# EAGLE schematic slave_v1_2 (EAGLE 9.6.2)
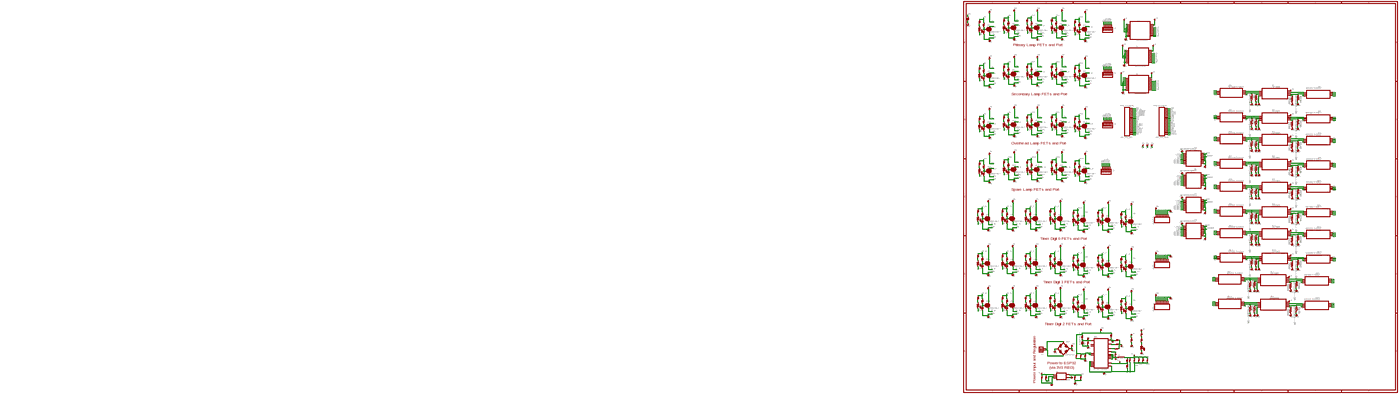
[diagram p0: schematic, sheet 1, overview]
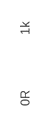
[diagram p1: schematic, sheet 1, part 1 of 5]
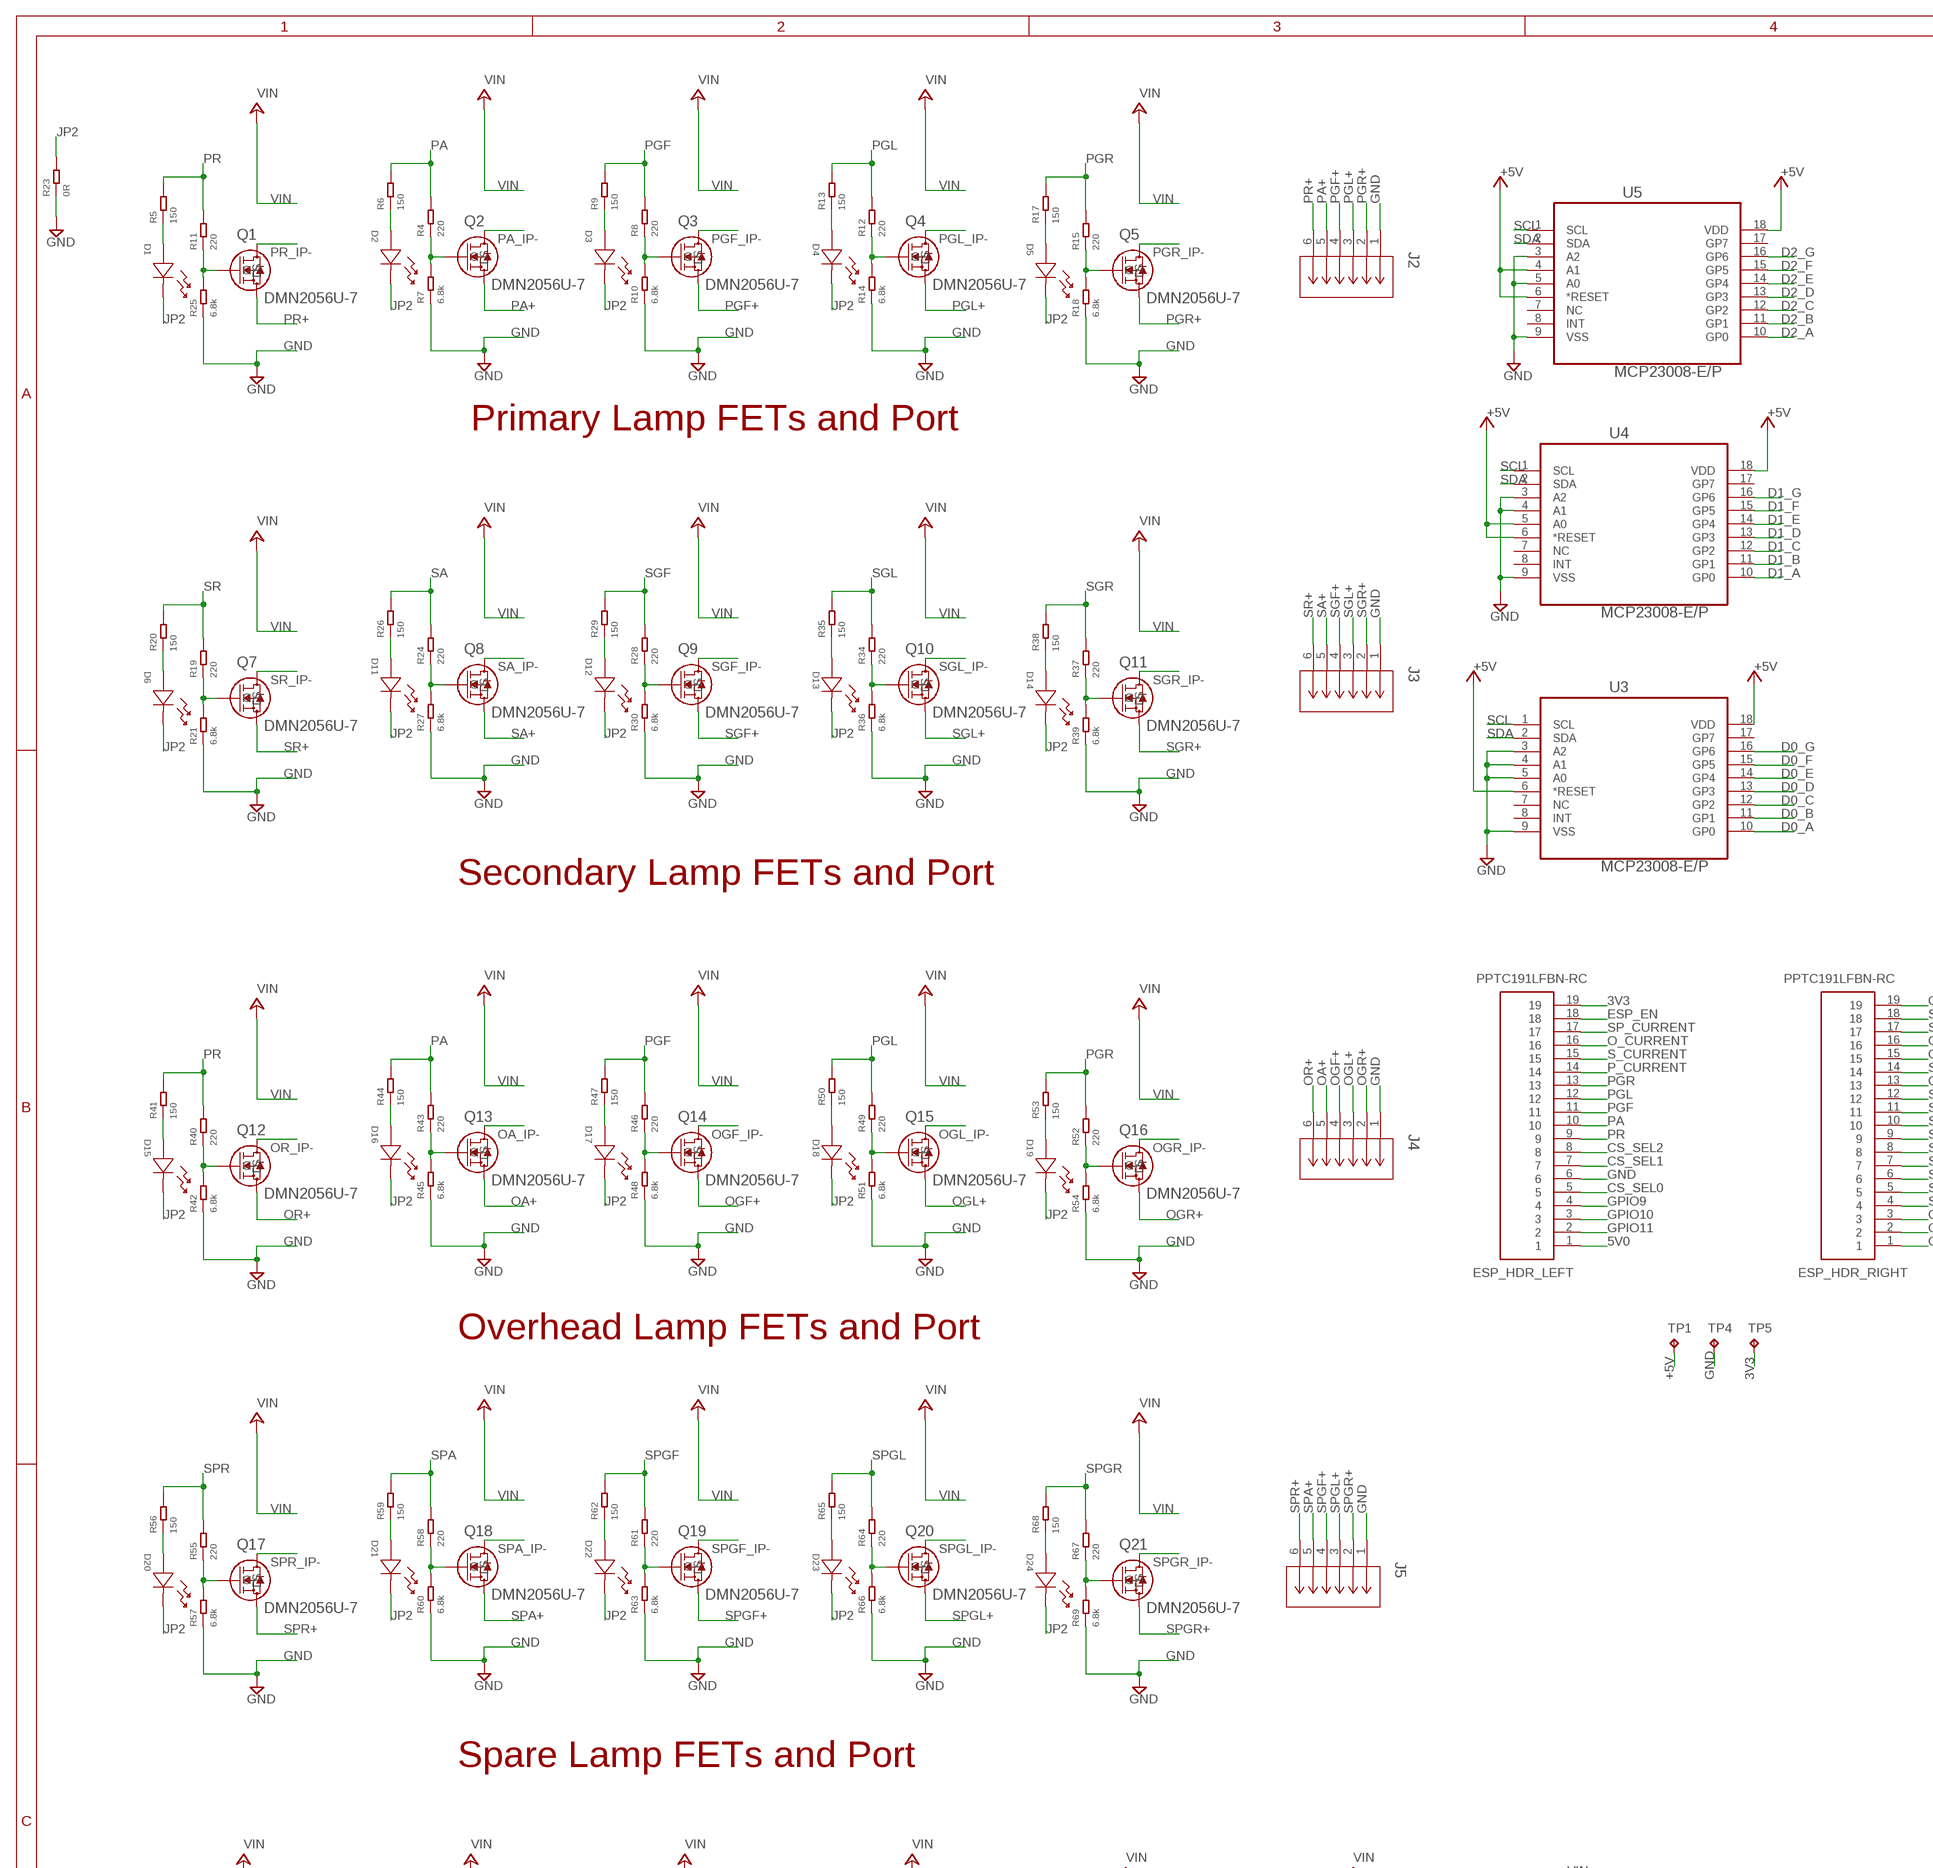
[diagram p2: schematic, sheet 1, part 2 of 5]
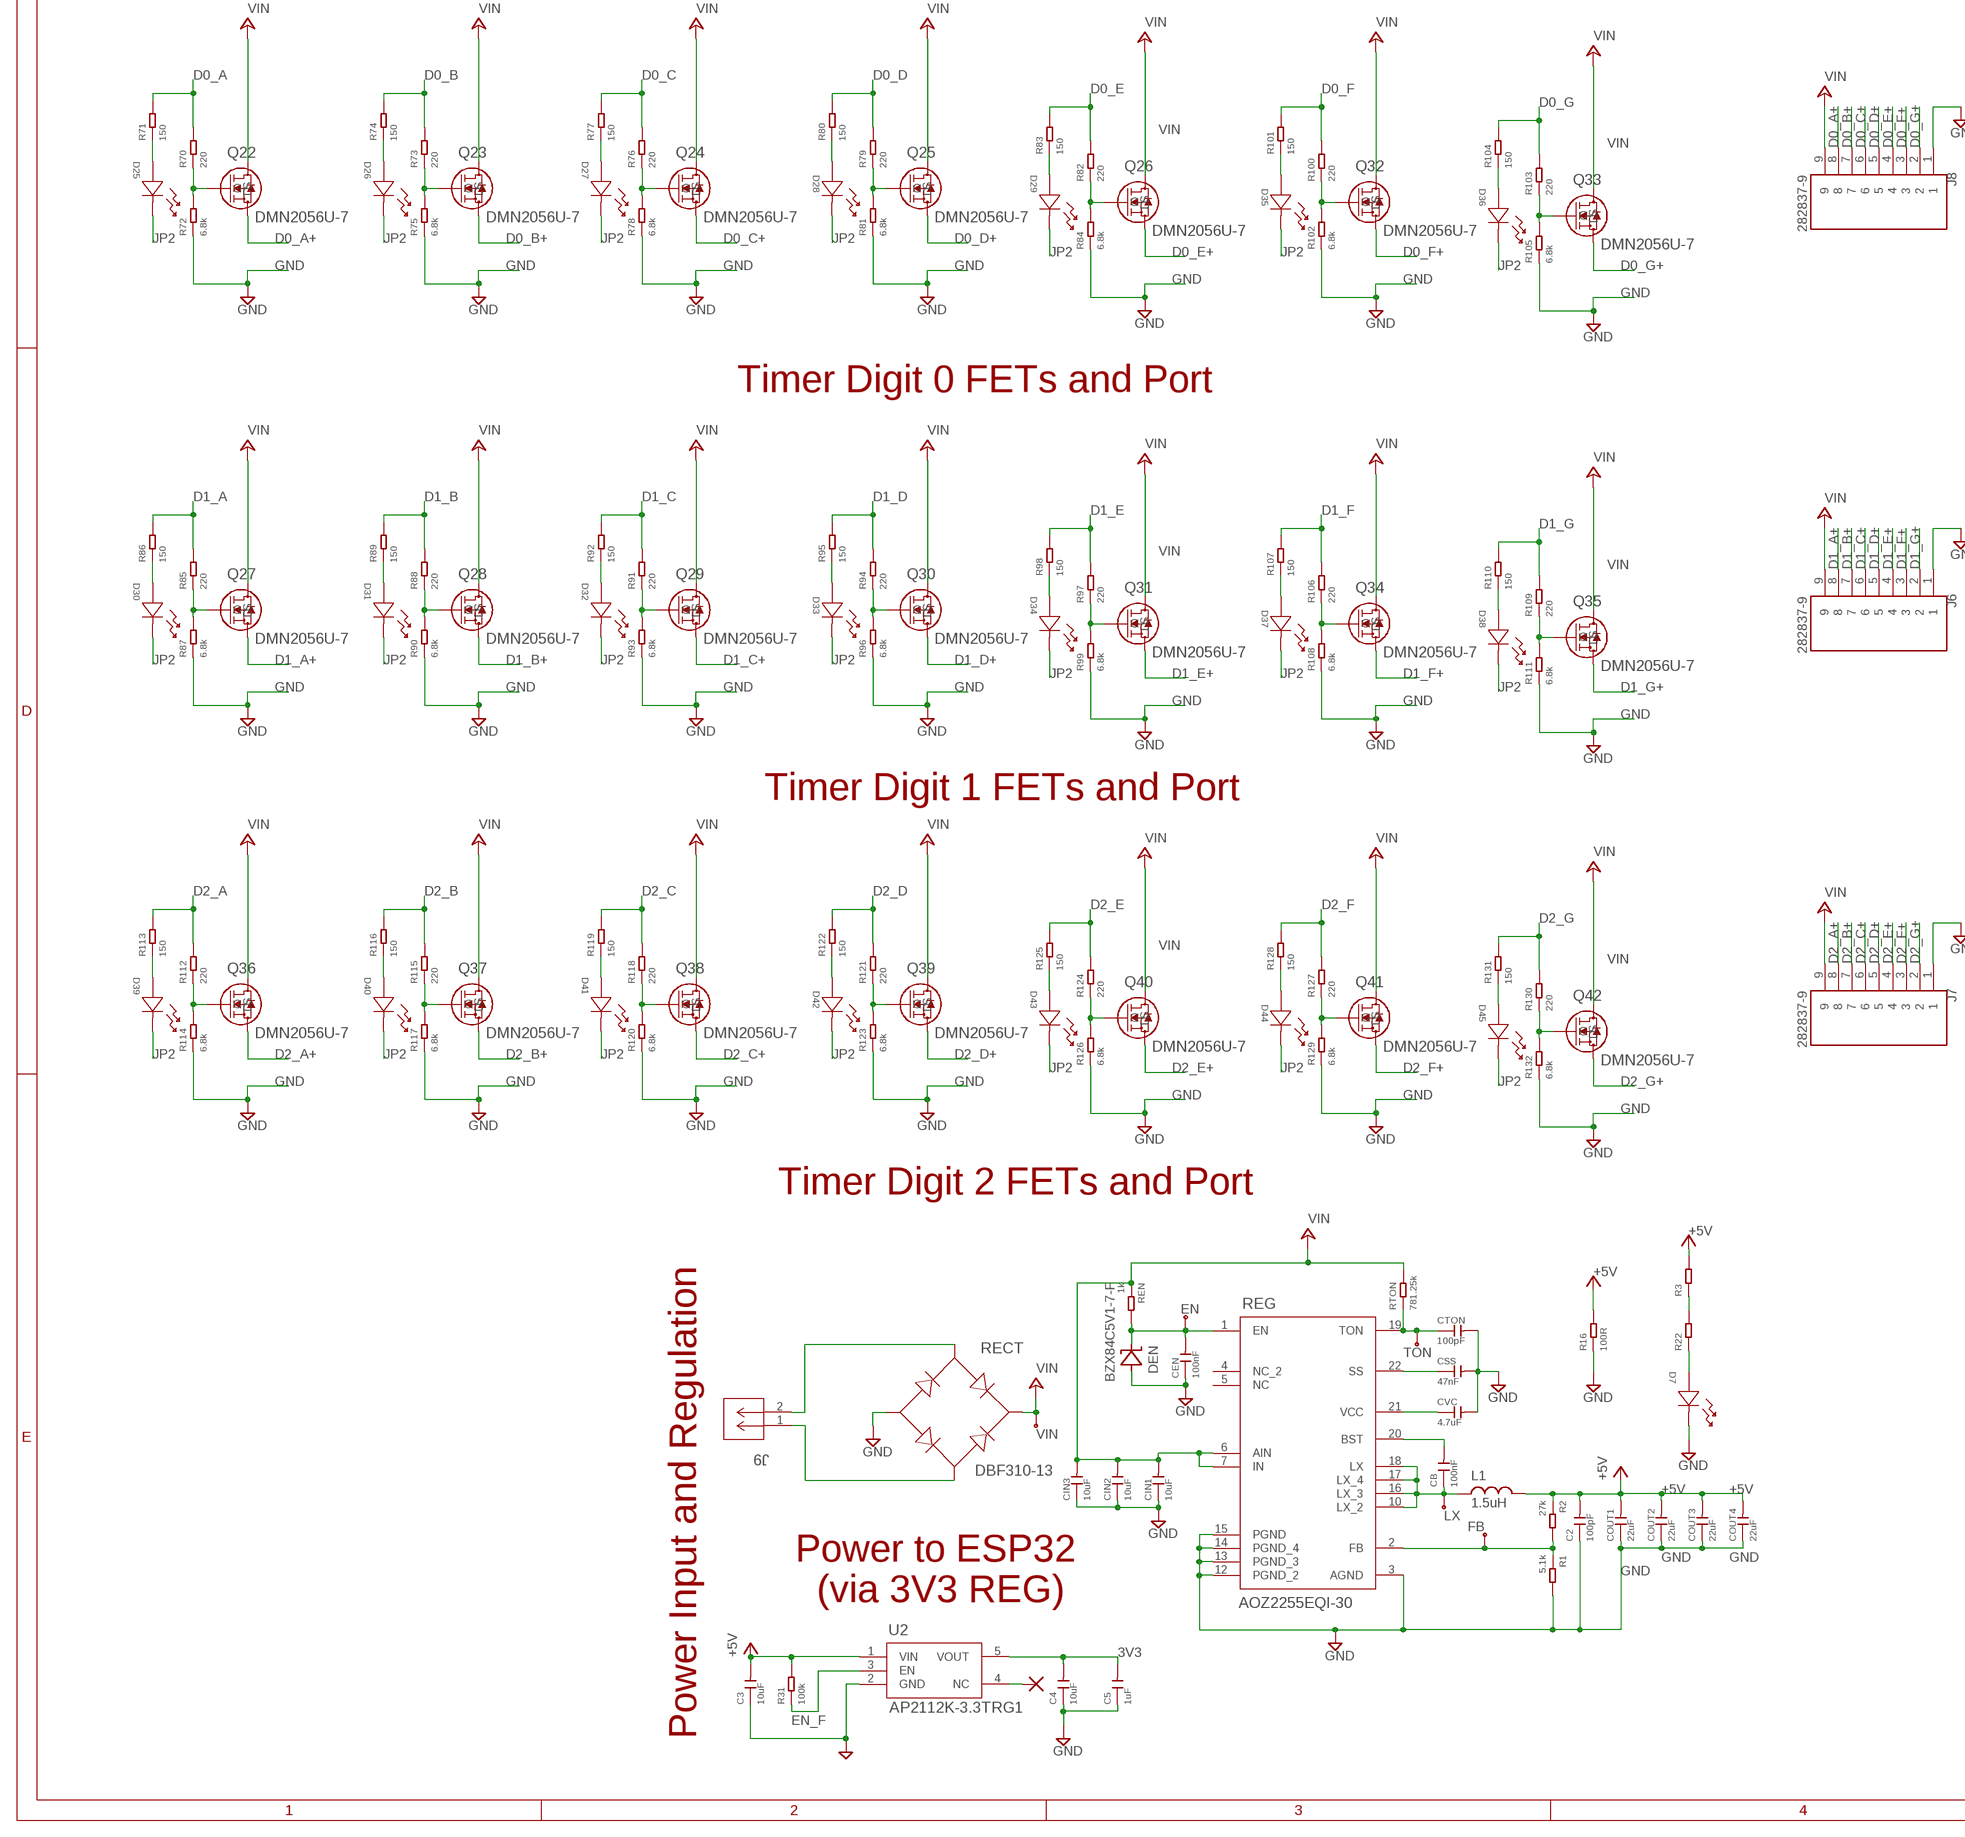
[diagram p3: schematic, sheet 1, part 3 of 5]
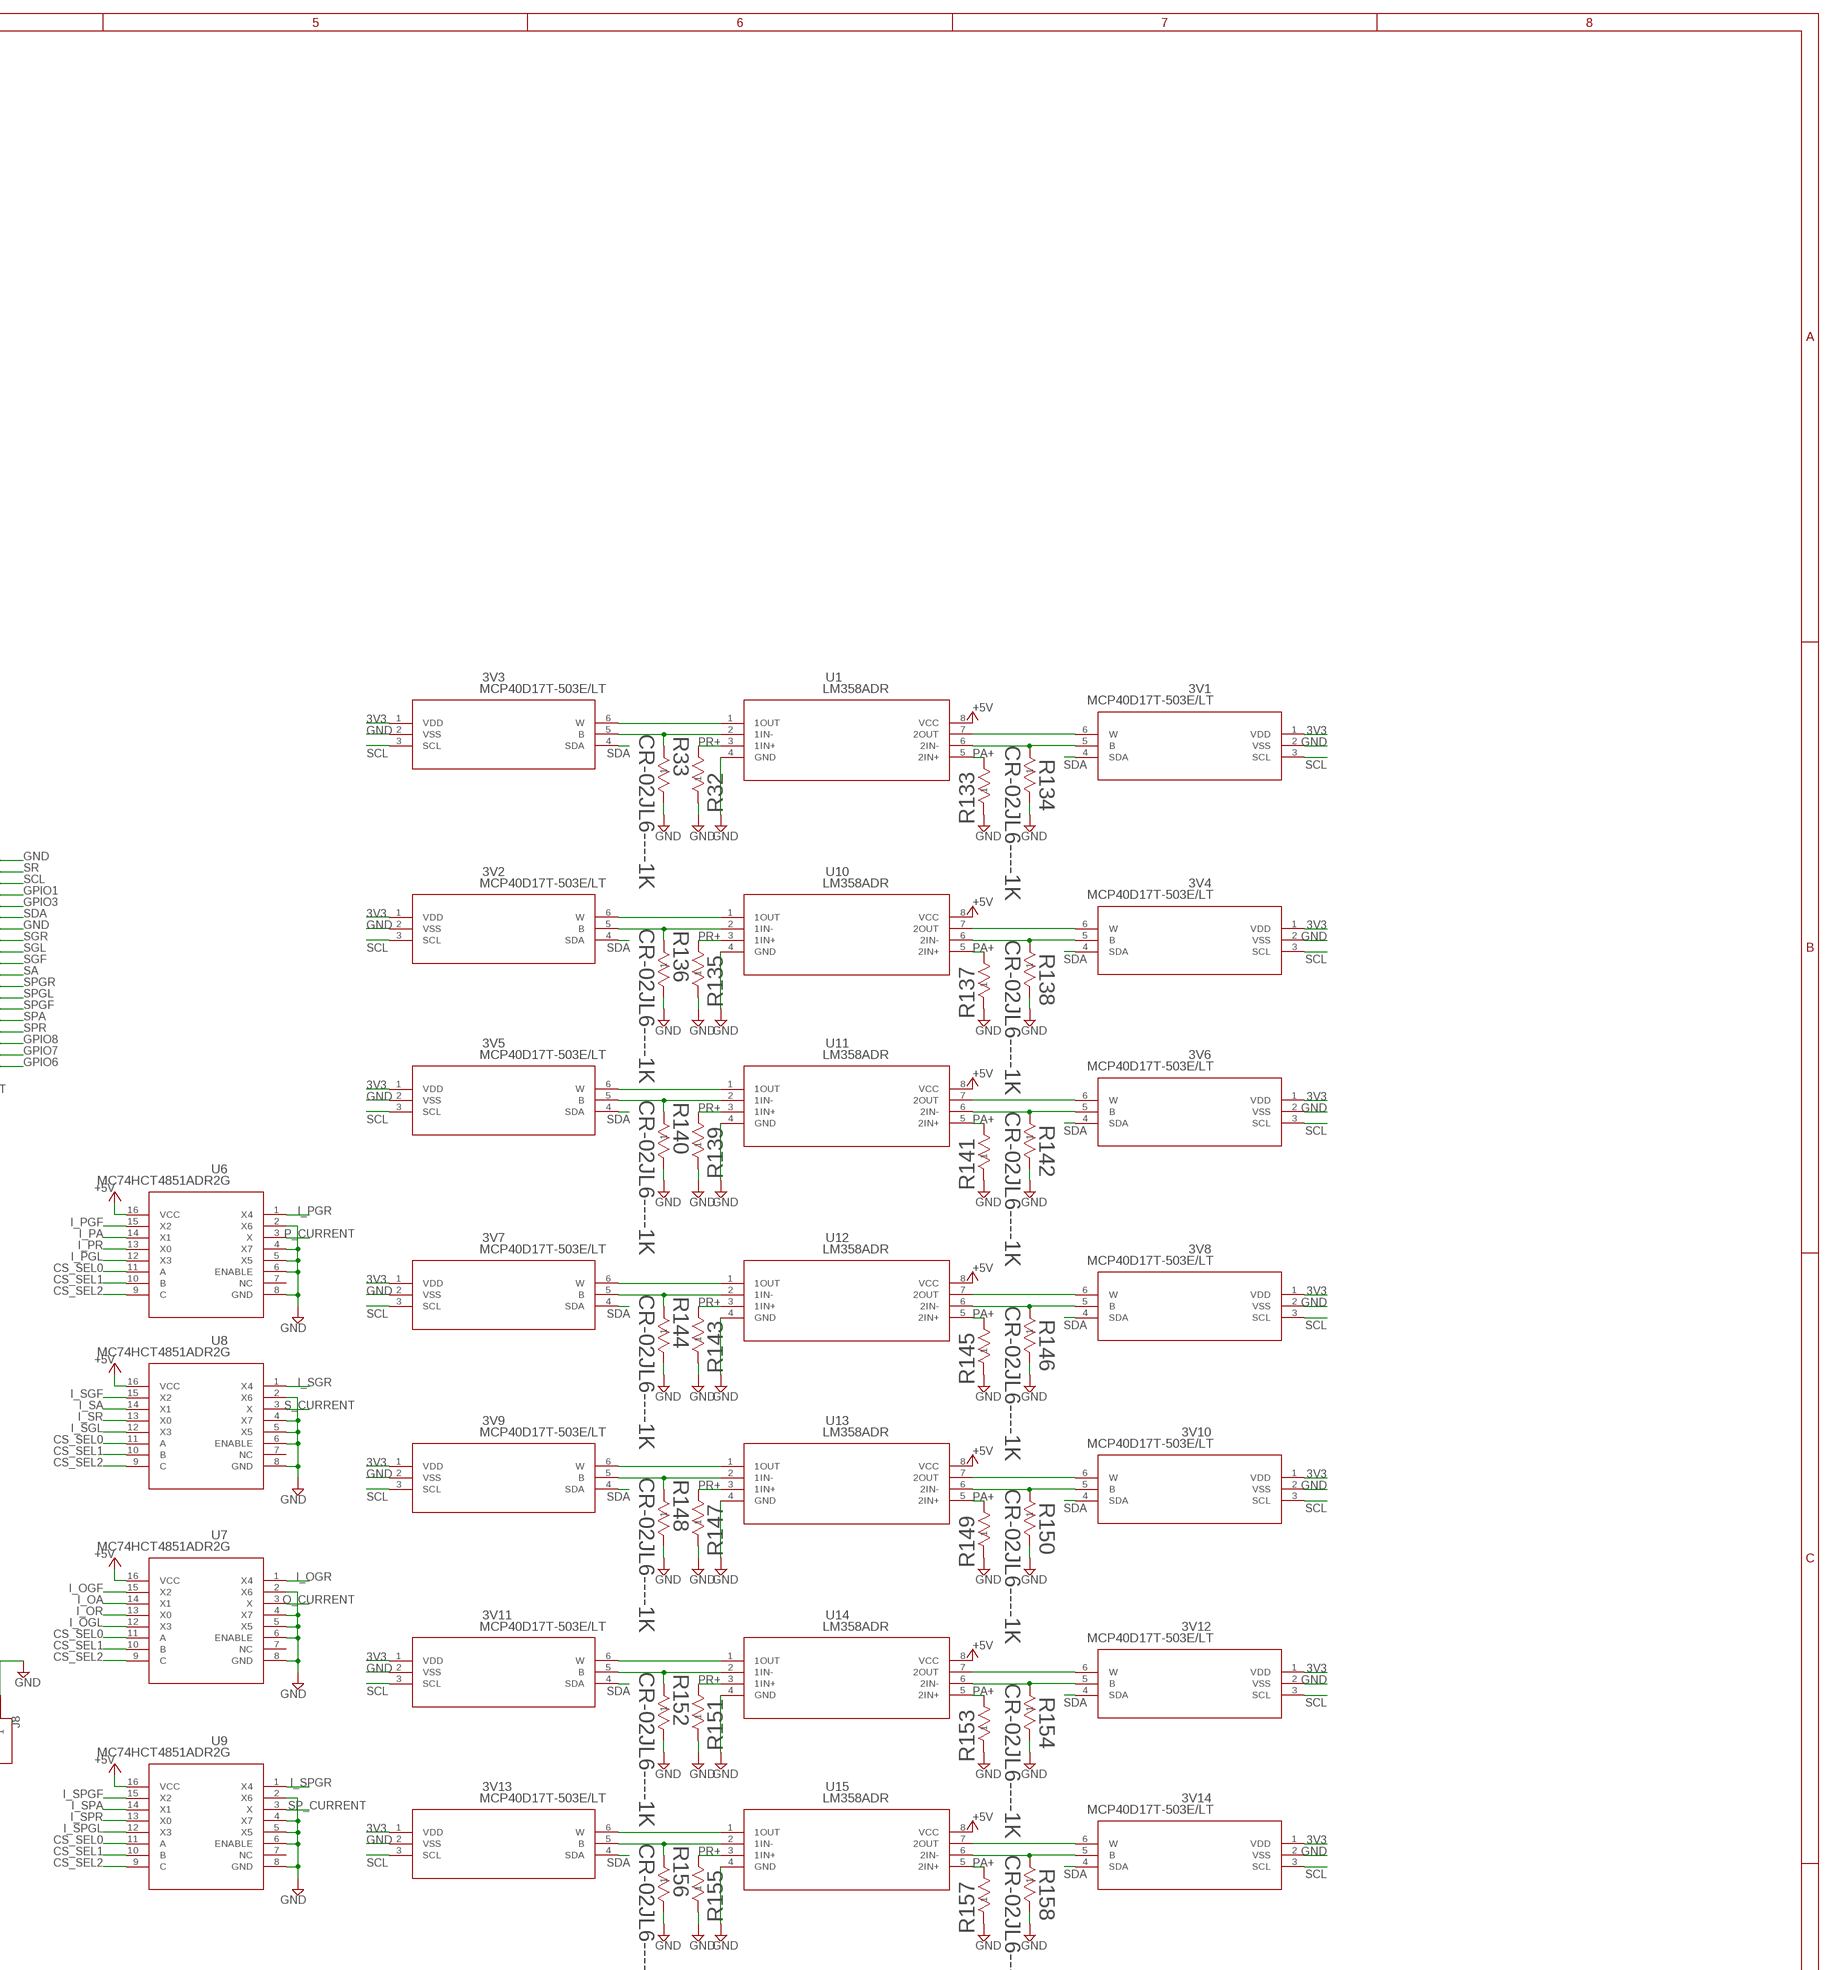
[diagram p4: schematic, sheet 1, part 4 of 5]
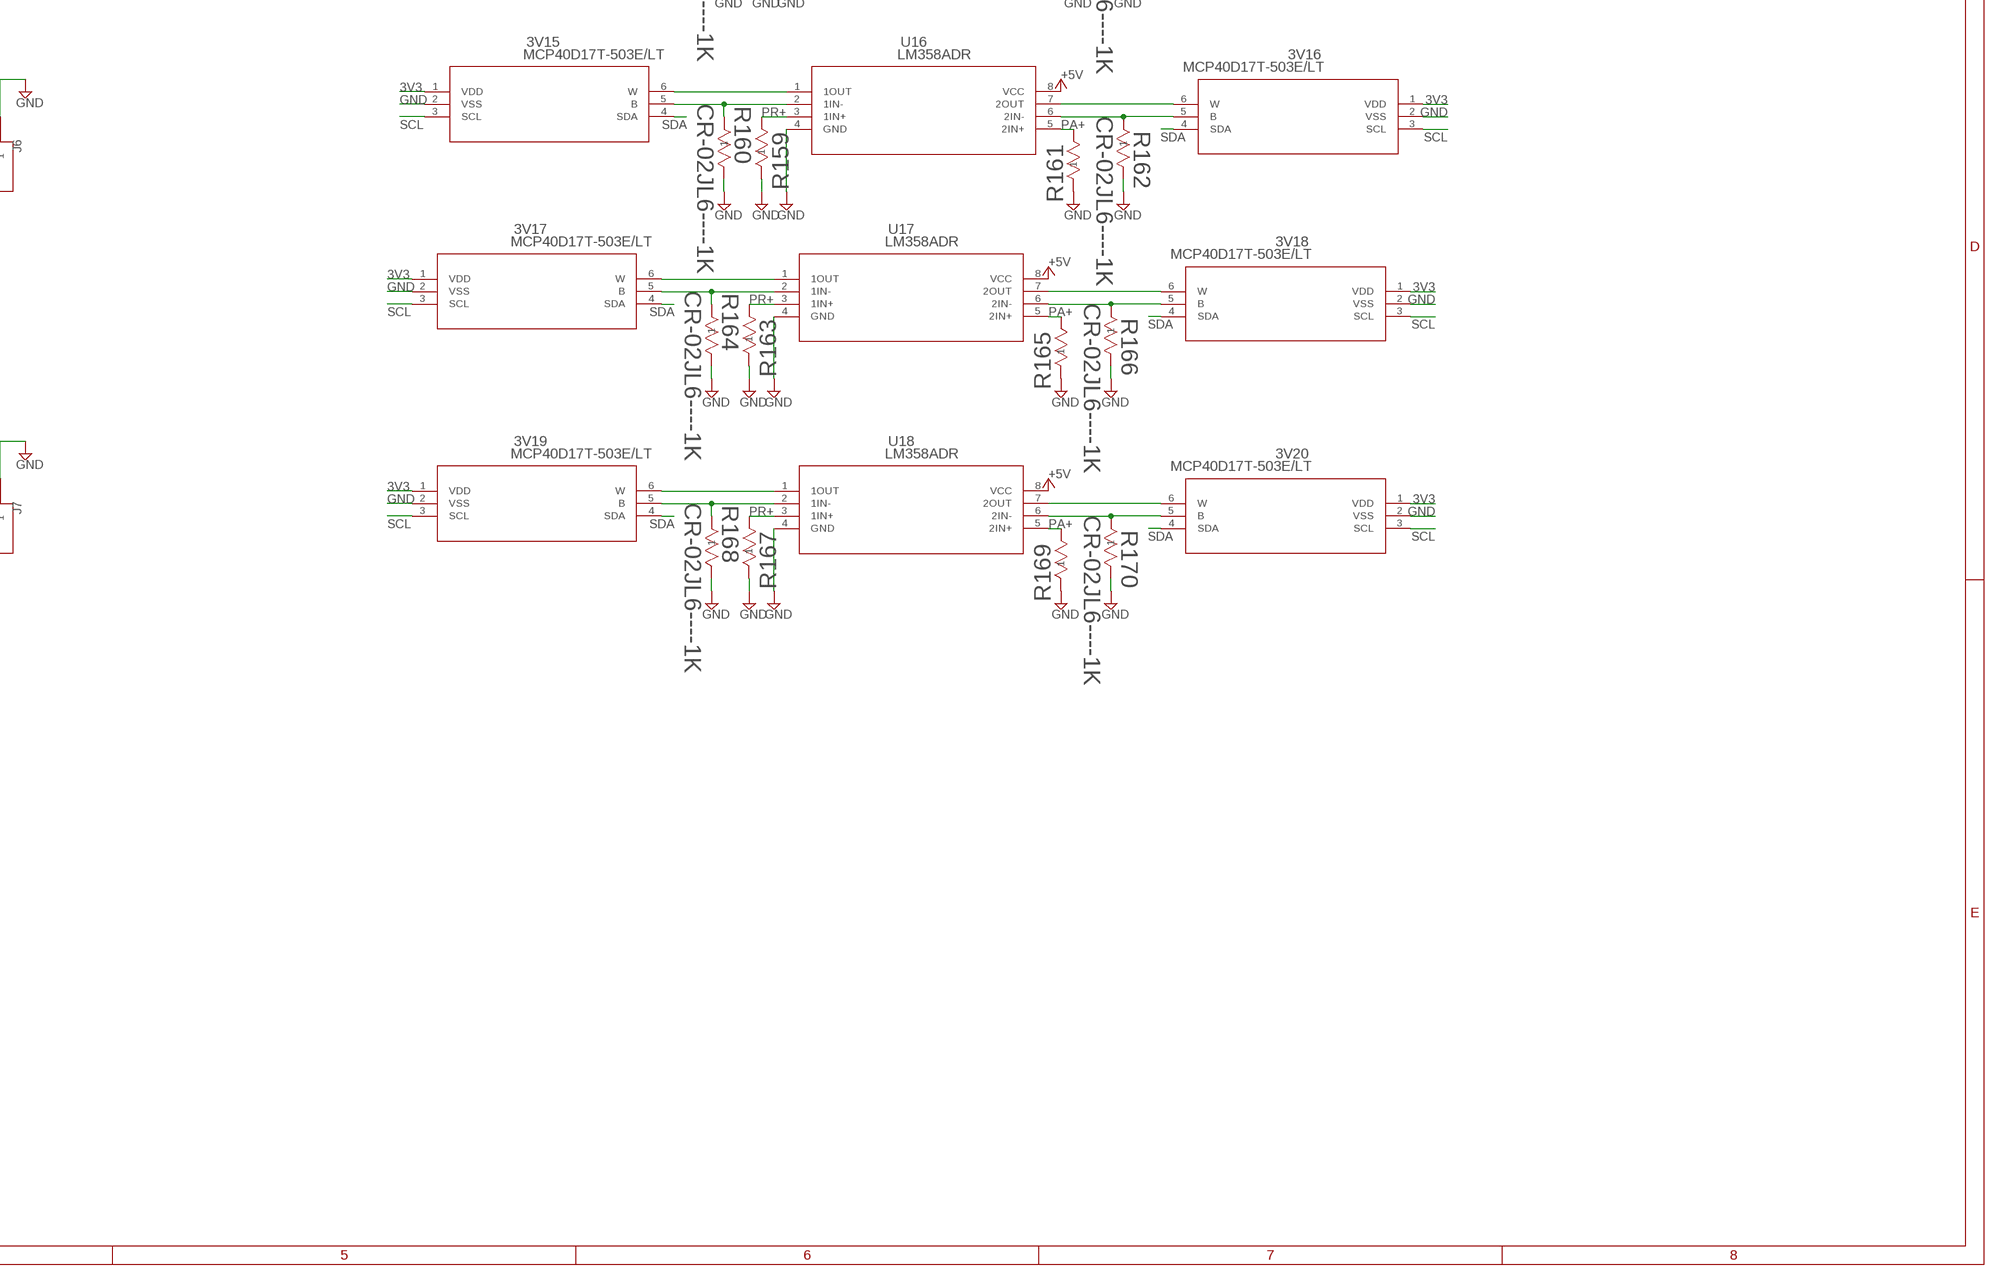
[diagram p5: schematic, sheet 1, part 5 of 5]

## Parts
3V1  MCP40D17T-503E/LT  [SC70-6_MC_MCH]
3V2  MCP40D17T-503E/LT  [SC70-6_MC_MCH]
3V3  MCP40D17T-503E/LT  [SC70-6_MC_MCH]
3V4  MCP40D17T-503E/LT  [SC70-6_MC_MCH]
3V5  MCP40D17T-503E/LT  [SC70-6_MC_MCH]
3V6  MCP40D17T-503E/LT  [SC70-6_MC_MCH]
3V7  MCP40D17T-503E/LT  [SC70-6_MC_MCH]
3V8  MCP40D17T-503E/LT  [SC70-6_MC_MCH]
3V9  MCP40D17T-503E/LT  [SC70-6_MC_MCH]
3V10  MCP40D17T-503E/LT  [SC70-6_MC_MCH]
3V11  MCP40D17T-503E/LT  [SC70-6_MC_MCH]
3V12  MCP40D17T-503E/LT  [SC70-6_MC_MCH]
3V13  MCP40D17T-503E/LT  [SC70-6_MC_MCH]
3V14  MCP40D17T-503E/LT  [SC70-6_MC_MCH]
3V15  MCP40D17T-503E/LT  [SC70-6_MC_MCH]
3V16  MCP40D17T-503E/LT  [SC70-6_MC_MCH]
3V17  MCP40D17T-503E/LT  [SC70-6_MC_MCH]
3V18  MCP40D17T-503E/LT  [SC70-6_MC_MCH]
3V19  MCP40D17T-503E/LT  [SC70-6_MC_MCH]
3V20  MCP40D17T-503E/LT  [SC70-6_MC_MCH]
C2  100pF  CERAMIC-1NF-50V-5%-C0G(0603)  [C0603]
C3  10uF  CERAMIC-4.7UF-25V-10%-X5R(0805)  [C0805]
C4  10uF  CERAMIC-4.7UF-25V-10%-X5R(0805)  [C0805]
C5  1uF  CERAMIC-1NF-50V-10%-X7R(0603)  [C0603]
CB  100nF  CERAMIC-1NF-50V-5%-C0G(0603)  [C0603]
CEN  100nF  CERAMIC-1NF-50V-5%-C0G(0603)  [C0603]
CIN1  10uF  CERAMIC-4.7UF-25V-10%-X5R(0805)  [C0805]
CIN2  10uF  CERAMIC-4.7UF-25V-10%-X5R(0805)  [C0805]
CIN3  10uF  CERAMIC-4.7UF-25V-10%-X5R(0805)  [C0805]
COUT1  22uF  CERAMIC-10UF-25V-10%-X5R(1206)  [C1206]
COUT2  22uF  CERAMIC-10UF-25V-10%-X5R(1206)  [C1206]
COUT3  22uF  CERAMIC-10UF-25V-10%-X5R(1206)  [C1206]
COUT4  22uF  CERAMIC-10UF-25V-10%-X5R(1206)  [C1206]
CSS  47nF  CERAMIC-1NF-50V-10%-X7R(0603)  [C0603]
CTON  100pF  CERAMIC-1.5PF-50V-0.1PF-NPO(0402)  [C0402]
CVC  4.7uF  CERAMIC-390PF-50V-10%-X7R(0402)  [C0402]
D1  VLMY1500-GS08  [LED_1500-GS08_VIS]
D2  VLMY1500-GS08  [LED_1500-GS08_VIS]
D3  VLMY1500-GS08  [LED_1500-GS08_VIS]
D4  VLMY1500-GS08  [LED_1500-GS08_VIS]
D5  VLMY1500-GS08  [LED_1500-GS08_VIS]
D6  VLMY1500-GS08  [LED_1500-GS08_VIS]
D7  VLMY1500-GS08  [LED_1500-GS08_VIS]
D11  VLMY1500-GS08  [LED_1500-GS08_VIS]
D12  VLMY1500-GS08  [LED_1500-GS08_VIS]
D13  VLMY1500-GS08  [LED_1500-GS08_VIS]
D14  VLMY1500-GS08  [LED_1500-GS08_VIS]
D15  VLMY1500-GS08  [LED_1500-GS08_VIS]
D16  VLMY1500-GS08  [LED_1500-GS08_VIS]
D17  VLMY1500-GS08  [LED_1500-GS08_VIS]
D18  VLMY1500-GS08  [LED_1500-GS08_VIS]
D19  VLMY1500-GS08  [LED_1500-GS08_VIS]
D20  VLMY1500-GS08  [LED_1500-GS08_VIS]
D21  VLMY1500-GS08  [LED_1500-GS08_VIS]
D22  VLMY1500-GS08  [LED_1500-GS08_VIS]
D23  VLMY1500-GS08  [LED_1500-GS08_VIS]
D24  VLMY1500-GS08  [LED_1500-GS08_VIS]
D25  VLMY1500-GS08  [LED_1500-GS08_VIS]
D26  VLMY1500-GS08  [LED_1500-GS08_VIS]
D27  VLMY1500-GS08  [LED_1500-GS08_VIS]
D28  VLMY1500-GS08  [LED_1500-GS08_VIS]
D29  VLMY1500-GS08  [LED_1500-GS08_VIS]
D30  VLMY1500-GS08  [LED_1500-GS08_VIS]
D31  VLMY1500-GS08  [LED_1500-GS08_VIS]
D32  VLMY1500-GS08  [LED_1500-GS08_VIS]
D33  VLMY1500-GS08  [LED_1500-GS08_VIS]
D34  VLMY1500-GS08  [LED_1500-GS08_VIS]
D35  VLMY1500-GS08  [LED_1500-GS08_VIS]
D36  VLMY1500-GS08  [LED_1500-GS08_VIS]
D37  VLMY1500-GS08  [LED_1500-GS08_VIS]
D38  VLMY1500-GS08  [LED_1500-GS08_VIS]
D39  VLMY1500-GS08  [LED_1500-GS08_VIS]
D40  VLMY1500-GS08  [LED_1500-GS08_VIS]
D41  VLMY1500-GS08  [LED_1500-GS08_VIS]
D42  VLMY1500-GS08  [LED_1500-GS08_VIS]
D43  VLMY1500-GS08  [LED_1500-GS08_VIS]
D44  VLMY1500-GS08  [LED_1500-GS08_VIS]
D45  VLMY1500-GS08  [LED_1500-GS08_VIS]
DEN  BZX84C5V1-7-F  ZENER_SOT23  [SOT23]
EN  CONN_HDR_1POS_0.1  [1X1]
ESP_HDR_LEFT  PPTC191LFBN-RC  [RHDR19W80P0X254_1X19_4876X254X]
ESP_HDR_RIGHT  PPTC191LFBN-RC  [RHDR19W80P0X254_1X19_4876X254X]
FB  CONN_HDR_1POS_0.1  [1X1]
J2  EB21A-06-D  [CONN_EB21A-06-D_ADM]
J3  EB21A-06-D  [CONN_EB21A-06-D_ADM]
J4  EB21A-06-D  [CONN_EB21A-06-D_ADM]
J5  EB21A-06-D  [CONN_EB21A-06-D_ADM]
J6  282837-9  [TE_282837-9]
J7  282837-9  [TE_282837-9]
J8  282837-9  [TE_282837-9]
J9  1715250000  [CONN2_250000_WED]
L1  1.5uH  BCIH1367-2R2M  [BCIH1367-2R2M]
LX  CONN_HDR_1POS_0.1  [1X1]
Q1  DMN2056U-7  DMN2056U-7SOT23  [SOT23]
Q2  DMN2056U-7  DMN2056U-7SOT23  [SOT23]
Q3  DMN2056U-7  DMN2056U-7SOT23  [SOT23]
Q4  DMN2056U-7  DMN2056U-7SOT23  [SOT23]
Q5  DMN2056U-7  DMN2056U-7SOT23  [SOT23]
Q7  DMN2056U-7  DMN2056U-7SOT23  [SOT23]
Q8  DMN2056U-7  DMN2056U-7SOT23  [SOT23]
Q9  DMN2056U-7  DMN2056U-7SOT23  [SOT23]
Q10  DMN2056U-7  DMN2056U-7SOT23  [SOT23]
Q11  DMN2056U-7  DMN2056U-7SOT23  [SOT23]
Q12  DMN2056U-7  DMN2056U-7SOT23  [SOT23]
Q13  DMN2056U-7  DMN2056U-7SOT23  [SOT23]
Q14  DMN2056U-7  DMN2056U-7SOT23  [SOT23]
Q15  DMN2056U-7  DMN2056U-7SOT23  [SOT23]
Q16  DMN2056U-7  DMN2056U-7SOT23  [SOT23]
Q17  DMN2056U-7  DMN2056U-7SOT23  [SOT23]
Q18  DMN2056U-7  DMN2056U-7SOT23  [SOT23]
Q19  DMN2056U-7  DMN2056U-7SOT23  [SOT23]
Q20  DMN2056U-7  DMN2056U-7SOT23  [SOT23]
Q21  DMN2056U-7  DMN2056U-7SOT23  [SOT23]
Q22  DMN2056U-7  DMN2056U-7SOT23  [SOT23]
Q23  DMN2056U-7  DMN2056U-7SOT23  [SOT23]
Q24  DMN2056U-7  DMN2056U-7SOT23  [SOT23]
Q25  DMN2056U-7  DMN2056U-7SOT23  [SOT23]
Q26  DMN2056U-7  DMN2056U-7SOT23  [SOT23]
Q27  DMN2056U-7  DMN2056U-7SOT23  [SOT23]
Q28  DMN2056U-7  DMN2056U-7SOT23  [SOT23]
Q29  DMN2056U-7  DMN2056U-7SOT23  [SOT23]
Q30  DMN2056U-7  DMN2056U-7SOT23  [SOT23]
Q31  DMN2056U-7  DMN2056U-7SOT23  [SOT23]
Q32  DMN2056U-7  DMN2056U-7SOT23  [SOT23]
Q33  DMN2056U-7  DMN2056U-7SOT23  [SOT23]
Q34  DMN2056U-7  DMN2056U-7SOT23  [SOT23]
Q35  DMN2056U-7  DMN2056U-7SOT23  [SOT23]
Q36  DMN2056U-7  DMN2056U-7SOT23  [SOT23]
Q37  DMN2056U-7  DMN2056U-7SOT23  [SOT23]
Q38  DMN2056U-7  DMN2056U-7SOT23  [SOT23]
Q39  DMN2056U-7  DMN2056U-7SOT23  [SOT23]
Q40  DMN2056U-7  DMN2056U-7SOT23  [SOT23]
Q41  DMN2056U-7  DMN2056U-7SOT23  [SOT23]
Q42  DMN2056U-7  DMN2056U-7SOT23  [SOT23]
R1  5.1k  SMD-RES-0R-1%-1/10W(0603)  [R0603]
R2  27k  SMD-RES-0R-1%-1/10W(0603)  [R0603]
R3  1k  SMD-RES-1.5K-1%-1/16W(0402)  [R0402]
R4  220  SMD-RES-0R-1%-1/10W(0603)  [R0603]
R5  150  SMD-RES-1.2K-1%-1/10W(0603)  [R0603]
R6  150  SMD-RES-1.2K-1%-1/10W(0603)  [R0603]
R7  6.8k  SMD-RES-0R-1%-1/10W(0603)  [R0603]
R8  220  SMD-RES-0R-1%-1/10W(0603)  [R0603]
R9  150  SMD-RES-1.2K-1%-1/10W(0603)  [R0603]
R10  6.8k  SMD-RES-0R-1%-1/10W(0603)  [R0603]
R11  220  SMD-RES-0R-1%-1/10W(0603)  [R0603]
R12  220  SMD-RES-0R-1%-1/10W(0603)  [R0603]
R13  150  SMD-RES-1.2K-1%-1/10W(0603)  [R0603]
R14  6.8k  SMD-RES-0R-1%-1/10W(0603)  [R0603]
R15  220  SMD-RES-0R-1%-1/10W(0603)  [R0603]
R16  100R  DIP-RES-(PR-D2.7XL8.5MM)  [PR-D2.7XL8.5MM]
R17  150  SMD-RES-1.2K-1%-1/10W(0603)  [R0603]
R18  6.8k  SMD-RES-0R-1%-1/10W(0603)  [R0603]
R19  220  SMD-RES-0R-1%-1/10W(0603)  [R0603]
R20  150  SMD-RES-1.2K-1%-1/10W(0603)  [R0603]
R21  6.8k  SMD-RES-0R-1%-1/10W(0603)  [R0603]
R22  0R  SMD-RES-1.5K-1%-1/16W(0402)  [R0402]
R23  0R  SMD-RES-1.5K-1%-1/16W(0402)  [R0402]
R24  220  SMD-RES-0R-1%-1/10W(0603)  [R0603]
R25  6.8k  SMD-RES-0R-1%-1/10W(0603)  [R0603]
R26  150  SMD-RES-1.2K-1%-1/10W(0603)  [R0603]
R27  6.8k  SMD-RES-0R-1%-1/10W(0603)  [R0603]
R28  220  SMD-RES-0R-1%-1/10W(0603)  [R0603]
R29  150  SMD-RES-1.2K-1%-1/10W(0603)  [R0603]
R30  6.8k  SMD-RES-0R-1%-1/10W(0603)  [R0603]
R31  100k  SMD-RES-1.5K-1%-1/16W(0402)  [R0402]
R32  1m  RLC16-R100JTP  [RES_RLC16_KYA]
R33  CR-02JL6----1K  [RES_CR-02_VKG]
R34  220  SMD-RES-0R-1%-1/10W(0603)  [R0603]
R35  150  SMD-RES-1.2K-1%-1/10W(0603)  [R0603]
R36  6.8k  SMD-RES-0R-1%-1/10W(0603)  [R0603]
R37  220  SMD-RES-0R-1%-1/10W(0603)  [R0603]
R38  150  SMD-RES-1.2K-1%-1/10W(0603)  [R0603]
R39  6.8k  SMD-RES-0R-1%-1/10W(0603)  [R0603]
R40  220  SMD-RES-0R-1%-1/10W(0603)  [R0603]
R41  150  SMD-RES-1.2K-1%-1/10W(0603)  [R0603]
R42  6.8k  SMD-RES-0R-1%-1/10W(0603)  [R0603]
R43  220  SMD-RES-0R-1%-1/10W(0603)  [R0603]
R44  150  SMD-RES-1.2K-1%-1/10W(0603)  [R0603]
R45  6.8k  SMD-RES-0R-1%-1/10W(0603)  [R0603]
R46  220  SMD-RES-0R-1%-1/10W(0603)  [R0603]
R47  150  SMD-RES-1.2K-1%-1/10W(0603)  [R0603]
R48  6.8k  SMD-RES-0R-1%-1/10W(0603)  [R0603]
R49  220  SMD-RES-0R-1%-1/10W(0603)  [R0603]
R50  150  SMD-RES-1.2K-1%-1/10W(0603)  [R0603]
R51  6.8k  SMD-RES-0R-1%-1/10W(0603)  [R0603]
R52  220  SMD-RES-0R-1%-1/10W(0603)  [R0603]
R53  150  SMD-RES-1.2K-1%-1/10W(0603)  [R0603]
R54  6.8k  SMD-RES-0R-1%-1/10W(0603)  [R0603]
R55  220  SMD-RES-0R-1%-1/10W(0603)  [R0603]
R56  150  SMD-RES-1.2K-1%-1/10W(0603)  [R0603]
R57  6.8k  SMD-RES-0R-1%-1/10W(0603)  [R0603]
R58  220  SMD-RES-0R-1%-1/10W(0603)  [R0603]
R59  150  SMD-RES-1.2K-1%-1/10W(0603)  [R0603]
R60  6.8k  SMD-RES-0R-1%-1/10W(0603)  [R0603]
R61  220  SMD-RES-0R-1%-1/10W(0603)  [R0603]
R62  150  SMD-RES-1.2K-1%-1/10W(0603)  [R0603]
R63  6.8k  SMD-RES-0R-1%-1/10W(0603)  [R0603]
R64  220  SMD-RES-0R-1%-1/10W(0603)  [R0603]
R65  150  SMD-RES-1.2K-1%-1/10W(0603)  [R0603]
R66  6.8k  SMD-RES-0R-1%-1/10W(0603)  [R0603]
R67  220  SMD-RES-0R-1%-1/10W(0603)  [R0603]
R68  150  SMD-RES-1.2K-1%-1/10W(0603)  [R0603]
R69  6.8k  SMD-RES-0R-1%-1/10W(0603)  [R0603]
R70  220  SMD-RES-0R-1%-1/10W(0603)  [R0603]
R71  150  SMD-RES-1.2K-1%-1/10W(0603)  [R0603]
R72  6.8k  SMD-RES-0R-1%-1/10W(0603)  [R0603]
R73  220  SMD-RES-0R-1%-1/10W(0603)  [R0603]
R74  150  SMD-RES-1.2K-1%-1/10W(0603)  [R0603]
R75  6.8k  SMD-RES-0R-1%-1/10W(0603)  [R0603]
R76  220  SMD-RES-0R-1%-1/10W(0603)  [R0603]
R77  150  SMD-RES-1.2K-1%-1/10W(0603)  [R0603]
R78  6.8k  SMD-RES-0R-1%-1/10W(0603)  [R0603]
R79  220  SMD-RES-0R-1%-1/10W(0603)  [R0603]
R80  150  SMD-RES-1.2K-1%-1/10W(0603)  [R0603]
R81  6.8k  SMD-RES-0R-1%-1/10W(0603)  [R0603]
R82  220  SMD-RES-0R-1%-1/10W(0603)  [R0603]
R83  150  SMD-RES-1.2K-1%-1/10W(0603)  [R0603]
R84  6.8k  SMD-RES-0R-1%-1/10W(0603)  [R0603]
R85  220  SMD-RES-0R-1%-1/10W(0603)  [R0603]
R86  150  SMD-RES-1.2K-1%-1/10W(0603)  [R0603]
R87  6.8k  SMD-RES-0R-1%-1/10W(0603)  [R0603]
R88  220  SMD-RES-0R-1%-1/10W(0603)  [R0603]
R89  150  SMD-RES-1.2K-1%-1/10W(0603)  [R0603]
R90  6.8k  SMD-RES-0R-1%-1/10W(0603)  [R0603]
R91  220  SMD-RES-0R-1%-1/10W(0603)  [R0603]
R92  150  SMD-RES-1.2K-1%-1/10W(0603)  [R0603]
R93  6.8k  SMD-RES-0R-1%-1/10W(0603)  [R0603]
R94  220  SMD-RES-0R-1%-1/10W(0603)  [R0603]
R95  150  SMD-RES-1.2K-1%-1/10W(0603)  [R0603]
R96  6.8k  SMD-RES-0R-1%-1/10W(0603)  [R0603]
R97  220  SMD-RES-0R-1%-1/10W(0603)  [R0603]
R98  150  SMD-RES-1.2K-1%-1/10W(0603)  [R0603]
R99  6.8k  SMD-RES-0R-1%-1/10W(0603)  [R0603]
R100  220  SMD-RES-0R-1%-1/10W(0603)  [R0603]
R101  150  SMD-RES-1.2K-1%-1/10W(0603)  [R0603]
R102  6.8k  SMD-RES-0R-1%-1/10W(0603)  [R0603]
R103  220  SMD-RES-0R-1%-1/10W(0603)  [R0603]
R104  150  SMD-RES-1.2K-1%-1/10W(0603)  [R0603]
R105  6.8k  SMD-RES-0R-1%-1/10W(0603)  [R0603]
R106  220  SMD-RES-0R-1%-1/10W(0603)  [R0603]
R107  150  SMD-RES-1.2K-1%-1/10W(0603)  [R0603]
R108  6.8k  SMD-RES-0R-1%-1/10W(0603)  [R0603]
R109  220  SMD-RES-0R-1%-1/10W(0603)  [R0603]
R110  150  SMD-RES-1.2K-1%-1/10W(0603)  [R0603]
R111  6.8k  SMD-RES-0R-1%-1/10W(0603)  [R0603]
R112  220  SMD-RES-0R-1%-1/10W(0603)  [R0603]
R113  150  SMD-RES-1.2K-1%-1/10W(0603)  [R0603]
R114  6.8k  SMD-RES-0R-1%-1/10W(0603)  [R0603]
R115  220  SMD-RES-0R-1%-1/10W(0603)  [R0603]
R116  150  SMD-RES-1.2K-1%-1/10W(0603)  [R0603]
R117  6.8k  SMD-RES-0R-1%-1/10W(0603)  [R0603]
R118  220  SMD-RES-0R-1%-1/10W(0603)  [R0603]
R119  150  SMD-RES-1.2K-1%-1/10W(0603)  [R0603]
R120  6.8k  SMD-RES-0R-1%-1/10W(0603)  [R0603]
R121  220  SMD-RES-0R-1%-1/10W(0603)  [R0603]
R122  150  SMD-RES-1.2K-1%-1/10W(0603)  [R0603]
R123  6.8k  SMD-RES-0R-1%-1/10W(0603)  [R0603]
R124  220  SMD-RES-0R-1%-1/10W(0603)  [R0603]
R125  150  SMD-RES-1.2K-1%-1/10W(0603)  [R0603]
R126  6.8k  SMD-RES-0R-1%-1/10W(0603)  [R0603]
R127  220  SMD-RES-0R-1%-1/10W(0603)  [R0603]
R128  150  SMD-RES-1.2K-1%-1/10W(0603)  [R0603]
R129  6.8k  SMD-RES-0R-1%-1/10W(0603)  [R0603]
R130  220  SMD-RES-0R-1%-1/10W(0603)  [R0603]
R131  150  SMD-RES-1.2K-1%-1/10W(0603)  [R0603]
R132  6.8k  SMD-RES-0R-1%-1/10W(0603)  [R0603]
R133  1m  RLC16-R100JTP  [RES_RLC16_KYA]
R134  CR-02JL6----1K  [RES_CR-02_VKG]
R135  1m  RLC16-R100JTP  [RES_RLC16_KYA]
R136  CR-02JL6----1K  [RES_CR-02_VKG]
R137  1m  RLC16-R100JTP  [RES_RLC16_KYA]
R138  CR-02JL6----1K  [RES_CR-02_VKG]
R139  1m  RLC16-R100JTP  [RES_RLC16_KYA]
R140  CR-02JL6----1K  [RES_CR-02_VKG]
R141  1m  RLC16-R100JTP  [RES_RLC16_KYA]
R142  CR-02JL6----1K  [RES_CR-02_VKG]
R143  1m  RLC16-R100JTP  [RES_RLC16_KYA]
R144  CR-02JL6----1K  [RES_CR-02_VKG]
R145  1m  RLC16-R100JTP  [RES_RLC16_KYA]
R146  CR-02JL6----1K  [RES_CR-02_VKG]
R147  1m  RLC16-R100JTP  [RES_RLC16_KYA]
R148  CR-02JL6----1K  [RES_CR-02_VKG]
R149  1m  RLC16-R100JTP  [RES_RLC16_KYA]
R150  CR-02JL6----1K  [RES_CR-02_VKG]
R151  1m  RLC16-R100JTP  [RES_RLC16_KYA]
R152  CR-02JL6----1K  [RES_CR-02_VKG]
R153  1m  RLC16-R100JTP  [RES_RLC16_KYA]
R154  CR-02JL6----1K  [RES_CR-02_VKG]
R155  1m  RLC16-R100JTP  [RES_RLC16_KYA]
R156  CR-02JL6----1K  [RES_CR-02_VKG]
R157  1m  RLC16-R100JTP  [RES_RLC16_KYA]
R158  CR-02JL6----1K  [RES_CR-02_VKG]
R159  1m  RLC16-R100JTP  [RES_RLC16_KYA]
R160  CR-02JL6----1K  [RES_CR-02_VKG]
R161  1m  RLC16-R100JTP  [RES_RLC16_KYA]
R162  CR-02JL6----1K  [RES_CR-02_VKG]
R163  1m  RLC16-R100JTP  [RES_RLC16_KYA]
R164  CR-02JL6----1K  [RES_CR-02_VKG]
R165  1m  RLC16-R100JTP  [RES_RLC16_KYA]
R166  CR-02JL6----1K  [RES_CR-02_VKG]
R167  1m  RLC16-R100JTP  [RES_RLC16_KYA]
R168  CR-02JL6----1K  [RES_CR-02_VKG]
R169  1m  RLC16-R100JTP  [RES_RLC16_KYA]
R170  CR-02JL6----1K  [RES_CR-02_VKG]
RECT  DBF310-13  [DBF_DIO]
REG  AOZ2255EQI-30  AOZ2255LQI-31  [QFN_4X4_22L-EP2_S_AOS]
REN  1k  SMD-RES-1.2K-1%-1/10W(0603)  [R0603]
RTON  781.25k  SMD-RES-0R-1%-1/10W(0603)  [R0603]
TON  CONN_HDR_1POS_0.1  [1X1]
TP1  TPB1,27  [B1,27]
TP4  TPB1,27  [B1,27]
TP5  TPB1,27  [B1,27]
U1  LM358ADR  [D8]
U2  AP2112K-3.3TRG1  [SOT_RG1_DIO]
U3  MCP23008-E/P  [DIP254P762X533-18]
U4  MCP23008-E/P  [DIP254P762X533-18]
U5  MCP23008-E/P  [DIP254P762X533-18]
U6  MC74HCT4851ADR2G  [SOIC-16_ONS]
U7  MC74HCT4851ADR2G  [SOIC-16_ONS]
U8  MC74HCT4851ADR2G  [SOIC-16_ONS]
U9  MC74HCT4851ADR2G  [SOIC-16_ONS]
U10  LM358ADR  [D8]
U11  LM358ADR  [D8]
U12  LM358ADR  [D8]
U13  LM358ADR  [D8]
U14  LM358ADR  [D8]
U15  LM358ADR  [D8]
U16  LM358ADR  [D8]
U17  LM358ADR  [D8]
U18  LM358ADR  [D8]
U$3  NC_MARKER  (no package)
VIN  CONN_HDR_1POS_0.1  [1X1]

## Nets
3V3: 3V1.1(VDD) 3V2.1(VDD) 3V3.1(VDD) 3V4.1(VDD) 3V5.1(VDD) 3V6.1(VDD) 3V7.1(VDD) 3V8.1(VDD) 3V9.1(VDD) 3V10.1(VDD) 3V11.1(VDD) 3V12.1(VDD) 3V13.1(VDD) 3V14.1(VDD) 3V15.1(VDD) 3V16.1(VDD) 3V17.1(VDD) 3V18.1(VDD) 3V19.1(VDD) 3V20.1(VDD) C4.2 C5.2 ESP_HDR_LEFT.19 TP5.TP U2.5(VOUT)
5V0: ESP_HDR_LEFT.1
+5V: C2.2 C3.2 COUT1.2 COUT2.2 COUT3.2 COUT4.2 L1.P$2 R2.1 R3.2 R16.2 R31.2 TP1.TP U1.8(VCC) U2.1(VIN) U3.6(*RESET) U3.18(VDD) U4.5(A0) U4.6(*RESET) U4.18(VDD) U5.4(A1) U5.6(*RESET) U5.18(VDD) U6.16(VCC) U7.16(VCC) U8.16(VCC) U9.16(VCC) U10.8(VCC) U11.8(VCC) U12.8(VCC) U13.8(VCC) U14.8(VCC) U15.8(VCC) U16.8(VCC) U17.8(VCC) U18.8(VCC)
+12V: J9.2 RECT.2
BST: CB.2 REG.20(BST)
CS_SEL0: ESP_HDR_LEFT.5 U6.11(A) U7.11(A) U8.11(A) U9.11(A)
CS_SEL1: ESP_HDR_LEFT.7 U6.10(B) U7.10(B) U8.10(B) U9.10(B)
CS_SEL2: ESP_HDR_LEFT.8 U6.9(C) U7.9(C) U8.9(C) U9.9(C)
D0_A: R70.2 R71.2 U3.10(GP0)
D0_A+: J8.8 Q22.P$2(S)
D0_B: R73.2 R74.2 U3.11(GP1)
D0_B+: J8.7 Q23.P$2(S)
D0_C: R76.2 R77.2 U3.12(GP2)
D0_C+: J8.6 Q24.P$2(S)
D0_D: R79.2 R80.2 U3.13(GP3)
D0_D+: J8.5 Q25.P$2(S)
D0_E: R82.2 R83.2 U3.14(GP4)
D0_E+: J8.4 Q26.P$2(S)
D0_F: R100.2 R101.2 U3.15(GP5)
D0_F+: J8.3 Q32.P$2(S)
D0_G: R103.2 R104.2 U3.16(GP6)
D0_G+: J8.2 Q33.P$2(S)
D1_A: R85.2 R86.2 U4.10(GP0)
D1_A+: J6.8 Q27.P$2(S)
D1_B: R88.2 R89.2 U4.11(GP1)
D1_B+: J6.7 Q28.P$2(S)
D1_C: R91.2 R92.2 U4.12(GP2)
D1_C+: J6.6 Q29.P$2(S)
D1_D: R94.2 R95.2 U4.13(GP3)
D1_D+: J6.5 Q30.P$2(S)
D1_E: R97.2 R98.2 U4.14(GP4)
D1_E+: J6.4 Q31.P$2(S)
D1_F: R106.2 R107.2 U4.15(GP5)
D1_F+: J6.3 Q34.P$2(S)
D1_G: R109.2 R110.2 U4.16(GP6)
D1_G+: J6.2 Q35.P$2(S)
D2_A: R112.2 R113.2 U5.10(GP0)
D2_A+: J7.8 Q36.P$2(S)
D2_B: R115.2 R116.2 U5.11(GP1)
D2_B+: J7.7 Q37.P$2(S)
D2_C: R118.2 R119.2 U5.12(GP2)
D2_C+: J7.6 Q38.P$2(S)
D2_D: R121.2 R122.2 U5.13(GP3)
D2_D+: J7.5 Q39.P$2(S)
D2_E: R124.2 R125.2 U5.14(GP4)
D2_E+: J7.4 Q40.P$2(S)
D2_F: R127.2 R128.2 U5.15(GP5)
D2_F+: J7.3 Q41.P$2(S)
D2_G: R130.2 R131.2 U5.16(GP6)
D2_G+: J7.2 Q42.P$2(S)
EN: CEN.2 DEN.P$3(C) EN.1 REG.1(EN) REN.2
EN_F: R31.1 U2.3(EN)
ESP_EN: ESP_HDR_LEFT.18
FB: FB.1 R1.1 R2.2 REG.2(FB)
GND: 3V1.2(VSS) 3V2.2(VSS) 3V3.2(VSS) 3V4.2(VSS) 3V5.2(VSS) 3V6.2(VSS) 3V7.2(VSS) 3V8.2(VSS) 3V9.2(VSS) 3V10.2(VSS) 3V11.2(VSS) 3V12.2(VSS) 3V13.2(VSS) 3V14.2(VSS) 3V15.2(VSS) 3V16.2(VSS) 3V17.2(VSS) 3V18.2(VSS) 3V19.2(VSS) 3V20.2(VSS) C2.1 C3.1 C4.1 C5.1 CEN.1 CIN1.1 CIN2.1 CIN3.1 COUT1.1 COUT2.1 COUT3.1 COUT4.1 CSS.2 CTON.2 CVC.2 D7.1 DEN.P$1(A) ESP_HDR_LEFT.6 ESP_HDR_RIGHT.13 ESP_HDR_RIGHT.19 J2.1 J3.1 J4.1 J5.1 J6.1 J7.1 J8.1 R1.2 R7.1 R10.1 R14.1 R16.1 R18.1 R21.1 R23.1 R25.1 R27.1 R30.1 R32.1 R33.2 R36.1 R39.1 R42.1 R45.1 R48.1 R51.1 R54.1 R57.1 R60.1 R63.1 R66.1 R69.1 R72.1 R75.1 R78.1 R81.1 R84.1 R87.1 R90.1 R93.1 R96.1 R99.1 R102.1 R105.1 R108.1 R111.1 R114.1 R117.1 R120.1 R123.1 R126.1 R129.1 R132.1 R133.1 R134.2 R135.1 R136.2 R137.1 R138.2 R139.1 R140.2 R141.1 R142.2 R143.1 R144.2 R145.1 R146.2 R147.1 R148.2 R149.1 R150.2 R151.1 R152.2 R153.1 R154.2 R155.1 R156.2 R157.1 R158.2 R159.1 R160.2 R161.1 R162.2 R163.1 R164.2 R165.1 R166.2 R167.1 R168.2 R169.1 R170.2 RECT.3 REG.3(AGND) REG.12(PGND_2) REG.13(PGND_3) REG.14(PGND_4) REG.15(PGND) TP4.TP U1.4(GND) U2.2(GND) U3.3(A2) U3.4(A1) U3.5(A0) U3.9(VSS) U4.3(A2) U4.4(A1) U4.9(VSS) U5.3(A2) U5.5(A0) U5.9(VSS) U6.2(X6) U6.4(X7) U6.5(X5) U6.6(ENABLE) U6.8(GND) U7.2(X6) U7.4(X7) U7.5(X5) U7.6(ENABLE) U7.8(GND) U8.2(X6) U8.4(X7) U8.5(X5) U8.6(ENABLE) U8.8(GND) U9.2(X6) U9.4(X7) U9.5(X5) U9.6(ENABLE) U9.8(GND) U10.4(GND) U11.4(GND) U12.4(GND) U13.4(GND) U14.4(GND) U15.4(GND) U16.4(GND) U17.4(GND) U18.4(GND)
GPIO1: ESP_HDR_RIGHT.16
GPIO3: ESP_HDR_RIGHT.15
GPIO6: ESP_HDR_RIGHT.1
GPIO7: ESP_HDR_RIGHT.2
GPIO8: ESP_HDR_RIGHT.3
GPIO9: ESP_HDR_LEFT.4
GPIO10: ESP_HDR_LEFT.3
GPIO11: ESP_HDR_LEFT.2
I_OA: U7.14(X1)
I_OGF: U7.15(X2)
I_OGL: U7.12(X3)
I_OGR: U7.1(X4)
I_OR: U7.13(X0)
I_PA: U6.14(X1)
I_PGF: U6.15(X2)
I_PGL: U6.12(X3)
I_PGR: U6.1(X4)
I_PR: U6.13(X0)
I_SA: U8.14(X1)
I_SGF: U8.15(X2)
I_SGL: U8.12(X3)
I_SGR: U8.1(X4)
I_SPA: U9.14(X1)
I_SPGF: U9.15(X2)
I_SPGL: U9.12(X3)
I_SPGR: U9.1(X4)
I_SPR: U9.13(X0)
I_SR: U8.13(X0)
JP2: D1.1 D2.1 D3.1 D4.1 D5.1 D6.1 D11.1 D12.1 D13.1 D14.1 D15.1 D16.1 D17.1 D18.1 D19.1 D20.1 D21.1 D22.1 D23.1 D24.1 D25.1 D26.1 D27.1 D28.1 D29.1 D30.1 D31.1 D32.1 D33.1 D34.1 D35.1 D36.1 D37.1 D38.1 D39.1 D40.1 D41.1 D42.1 D43.1 D44.1 D45.1 R23.2
LX: CB.1 L1.P$1 LX.1 REG.10(LX_2) REG.16(LX_3) REG.17(LX_4) REG.18(LX)
N$1: D2.2 R6.1
N$2: R3.1 R22.2
N$3: D7.2 R22.1
N$4: 3V3.6(W) U1.1(1OUT)
N$5: 3V1.5(B) R134.1 U1.6(2IN-)
N$6: 3V1.6(W) U1.7(2OUT)
N$7: D3.2 R9.1
N$8: U2.4(NC) U$3.P$1
N$9: J9.1 RECT.4
N$10: 3V4.5(B) R138.1 U10.6(2IN-)
N$11: 3V3.5(B) R33.1 U1.2(1IN-)
N$12: 3V2.5(B) R136.1 U10.2(1IN-)
N$13: 3V2.6(W) U10.1(1OUT)
N$14: 3V4.6(W) U10.7(2OUT)
N$15: D1.2 R5.1
N$16: 3V6.5(B) R142.1 U11.6(2IN-)
N$17: 3V5.5(B) R140.1 U11.2(1IN-)
N$18: D4.2 R13.1
N$19: 3V5.6(W) U11.1(1OUT)
N$20: 3V6.6(W) U11.7(2OUT)
N$21: D5.2 R17.1
N$22: 3V8.5(B) R146.1 U12.6(2IN-)
N$23: 3V7.5(B) R144.1 U12.2(1IN-)
N$24: D6.2 R20.1
N$25: 3V7.6(W) U12.1(1OUT)
N$26: 3V8.6(W) U12.7(2OUT)
N$27: D11.2 R26.1
N$28: 3V10.5(B) R150.1 U13.6(2IN-)
N$29: 3V9.5(B) R148.1 U13.2(1IN-)
N$30: 3V9.6(W) U13.1(1OUT)
N$31: 3V10.6(W) U13.7(2OUT)
N$32: 3V12.5(B) R154.1 U14.6(2IN-)
N$33: 3V11.5(B) R152.1 U14.2(1IN-)
N$34: 3V11.6(W) U14.1(1OUT)
N$35: 3V12.6(W) U14.7(2OUT)
N$36: 3V14.5(B) R158.1 U15.6(2IN-)
N$37: 3V13.5(B) R156.1 U15.2(1IN-)
N$38: 3V13.6(W) U15.1(1OUT)
N$39: 3V14.6(W) U15.7(2OUT)
N$40: 3V16.5(B) R162.1 U16.6(2IN-)
N$41: 3V15.5(B) R160.1 U16.2(1IN-)
N$42: 3V15.6(W) U16.1(1OUT)
N$43: 3V16.6(W) U16.7(2OUT)
N$44: 3V18.5(B) R166.1 U17.6(2IN-)
N$45: 3V17.5(B) R164.1 U17.2(1IN-)
N$46: 3V17.6(W) U17.1(1OUT)
N$47: 3V18.6(W) U17.7(2OUT)
N$48: 3V20.5(B) R170.1 U18.6(2IN-)
N$49: 3V19.5(B) R168.1 U18.2(1IN-)
N$50: 3V19.6(W) U18.1(1OUT)
N$51: 3V20.6(W) U18.7(2OUT)
N$67: D12.2 R29.1
N$68: D13.2 R35.1
N$69: D14.2 R38.1
N$70: D15.2 R41.1
N$71: D16.2 R44.1
N$72: D17.2 R47.1
N$73: D18.2 R50.1
N$74: D19.2 R53.1
N$75: D20.2 R56.1
N$76: D21.2 R59.1
N$77: D22.2 R62.1
N$78: D23.2 R65.1
N$79: D24.2 R68.1
N$80: D25.2 R71.1
N$95: D26.2 R74.1
N$96: D27.2 R77.1
N$97: D28.2 R80.1
N$98: D29.2 R83.1
N$99: D30.2 R86.1
N$100: D31.2 R89.1
N$101: D32.2 R92.1
N$102: D33.2 R95.1
N$103: D34.2 R98.1
N$104: D35.2 R101.1
N$105: D36.2 R104.1
N$106: D37.2 R107.1
N$107: D38.2 R110.1
N$108: D39.2 R113.1
N$109: D40.2 R116.1
N$110: D41.2 R119.1
N$111: D42.2 R122.1
N$112: D43.2 R125.1
N$113: D44.2 R128.1
N$114: D45.2 R131.1
O_CURRENT: ESP_HDR_LEFT.16 U7.3(X)
OA+: J4.5 Q13.P$2(S)
OA_IP-: Q13.P$3(D)
OGF+: J4.4 Q14.P$2(S)
OGF_IP-: Q14.P$3(D)
OGL+: J4.3 Q15.P$2(S)
OGL_IP-: Q15.P$3(D)
OGR+: J4.2 Q16.P$2(S)
OGR_IP-: Q16.P$3(D)
OR+: J4.6 Q12.P$2(S)
OR_IP-: Q12.P$3(D)
P_CURRENT: ESP_HDR_LEFT.14 U6.3(X)
PA: ESP_HDR_LEFT.10 R4.2 R6.2 R43.2 R44.2
PA+: J2.5 Q2.P$2(S) R133.2 R137.2 R141.2 R145.2 R149.2 R153.2 R157.2 R161.2 R165.2 R169.2 U1.5(2IN+) U10.5(2IN+) U11.5(2IN+) U12.5(2IN+) U13.5(2IN+) U14.5(2IN+) U15.5(2IN+) U16.5(2IN+) U17.5(2IN+) U18.5(2IN+)
PA_IP-: Q2.P$3(D)
PGF: ESP_HDR_LEFT.11 R8.2 R9.2 R46.2 R47.2
PGF+: J2.4 Q3.P$2(S)
PGF_IP-: Q3.P$3(D)
PGL: ESP_HDR_LEFT.12 R12.2 R13.2 R49.2 R50.2
PGL+: J2.3 Q4.P$2(S)
PGL_IP-: Q4.P$3(D)
PGR: ESP_HDR_LEFT.13 R15.2 R17.2 R52.2 R53.2
PGR+: J2.2 Q5.P$2(S)
PGR_IP-: Q5.P$3(D)
PR: ESP_HDR_LEFT.9 R5.2 R11.2 R40.2 R41.2
PR+: J2.6 Q1.P$2(S) R32.2 R135.2 R139.2 R143.2 R147.2 R151.2 R155.2 R159.2 R163.2 R167.2 U1.3(1IN+) U10.3(1IN+) U11.3(1IN+) U12.3(1IN+) U13.3(1IN+) U14.3(1IN+) U15.3(1IN+) U16.3(1IN+) U17.3(1IN+) U18.3(1IN+)
PR_IP-: Q1.P$3(D)
Q1G: Q1.P$1(G) R11.1 R25.2
Q1G1: Q2.P$1(G) R4.1 R7.2
Q1G2: Q3.P$1(G) R8.1 R10.2
Q1G3: Q4.P$1(G) R12.1 R14.2
Q1G4: Q5.P$1(G) R15.1 R18.2
Q1G5: Q7.P$1(G) R19.1 R21.2
Q1G6: Q8.P$1(G) R24.1 R27.2
Q1G7: Q9.P$1(G) R28.1 R30.2
Q1G8: Q10.P$1(G) R34.1 R36.2
Q1G9: Q11.P$1(G) R37.1 R39.2
Q1G10: Q12.P$1(G) R40.1 R42.2
Q1G11: Q13.P$1(G) R43.1 R45.2
Q1G12: Q14.P$1(G) R46.1 R48.2
Q1G13: Q15.P$1(G) R49.1 R51.2
Q1G14: Q16.P$1(G) R52.1 R54.2
Q1G15: Q17.P$1(G) R55.1 R57.2
Q1G16: Q18.P$1(G) R58.1 R60.2
Q1G17: Q19.P$1(G) R61.1 R63.2
Q1G18: Q20.P$1(G) R64.1 R66.2
Q1G19: Q21.P$1(G) R67.1 R69.2
Q1G20: Q22.P$1(G) R70.1 R72.2
Q1G21: Q23.P$1(G) R73.1 R75.2
Q1G22: Q24.P$1(G) R76.1 R78.2
Q1G23: Q25.P$1(G) R79.1 R81.2
Q1G24: Q26.P$1(G) R82.1 R84.2
Q1G25: Q27.P$1(G) R85.1 R87.2
Q1G26: Q28.P$1(G) R88.1 R90.2
Q1G27: Q29.P$1(G) R91.1 R93.2
Q1G28: Q30.P$1(G) R94.1 R96.2
Q1G29: Q31.P$1(G) R97.1 R99.2
Q1G30: Q32.P$1(G) R100.1 R102.2
Q1G31: Q33.P$1(G) R103.1 R105.2
Q1G32: Q34.P$1(G) R106.1 R108.2
Q1G33: Q35.P$1(G) R109.1 R111.2
Q1G34: Q36.P$1(G) R112.1 R114.2
Q1G35: Q37.P$1(G) R115.1 R117.2
Q1G36: Q38.P$1(G) R118.1 R120.2
Q1G37: Q39.P$1(G) R121.1 R123.2
Q1G38: Q40.P$1(G) R124.1 R126.2
Q1G39: Q41.P$1(G) R127.1 R129.2
Q1G40: Q42.P$1(G) R130.1 R132.2
S_CURRENT: ESP_HDR_LEFT.15 U8.3(X)
SA: ESP_HDR_RIGHT.9 R24.2 R26.2
SA+: J3.5 Q8.P$2(S)
SA_IP-: Q8.P$3(D)
SCL: 3V1.3(SCL) 3V2.3(SCL) 3V3.3(SCL) 3V4.3(SCL) 3V5.3(SCL) 3V6.3(SCL) 3V7.3(SCL) 3V8.3(SCL) 3V9.3(SCL) 3V10.3(SCL) 3V11.3(SCL) 3V12.3(SCL) 3V13.3(SCL) 3V14.3(SCL) 3V15.3(SCL) 3V16.3(SCL) 3V17.3(SCL) 3V18.3(SCL) 3V19.3(SCL) 3V20.3(SCL) ESP_HDR_RIGHT.17 U3.1(SCL) U4.1(SCL) U5.1(SCL)
SDA: 3V1.4(SDA) 3V2.4(SDA) 3V3.4(SDA) 3V4.4(SDA) 3V5.4(SDA) 3V6.4(SDA) 3V7.4(SDA) 3V8.4(SDA) 3V9.4(SDA) 3V10.4(SDA) 3V11.4(SDA) 3V12.4(SDA) 3V13.4(SDA) 3V14.4(SDA) 3V15.4(SDA) 3V16.4(SDA) 3V17.4(SDA) 3V18.4(SDA) 3V19.4(SDA) 3V20.4(SDA) ESP_HDR_RIGHT.14 U3.2(SDA) U4.2(SDA) U5.2(SDA)
SGF: ESP_HDR_RIGHT.10 R28.2 R29.2
SGF+: J3.4 Q9.P$2(S)
SGF_IP-: Q9.P$3(D)
SGL: ESP_HDR_RIGHT.11 R34.2 R35.2
SGL+: J3.3 Q10.P$2(S)
SGL_IP-: Q10.P$3(D)
SGR: ESP_HDR_RIGHT.12 R37.2 R38.2
SGR+: J3.2 Q11.P$2(S)
SGR_IP-: Q11.P$3(D)
SP_CURRENT: ESP_HDR_LEFT.17 U9.3(X)
SPA: ESP_HDR_RIGHT.5 R58.2 R59.2
SPA+: J5.5 Q18.P$2(S)
SPA_IP-: Q18.P$3(D)
SPGF: ESP_HDR_RIGHT.6 R61.2 R62.2
SPGF+: J5.4 Q19.P$2(S)
SPGF_IP-: Q19.P$3(D)
SPGL: ESP_HDR_RIGHT.7 R64.2 R65.2
SPGL+: J5.3 Q20.P$2(S)
SPGL_IP-: Q20.P$3(D)
SPGR: ESP_HDR_RIGHT.8 R67.2 R68.2
SPGR+: J5.2 Q21.P$2(S)
SPGR_IP-: Q21.P$3(D)
SPR: ESP_HDR_RIGHT.4 R55.2 R56.2
SPR+: J5.6 Q17.P$2(S)
SPR_IP-: Q17.P$3(D)
SR: ESP_HDR_RIGHT.18 R19.2 R20.2
SR+: J3.6 Q7.P$2(S)
SR_IP-: Q7.P$3(D)
SS: CSS.1 REG.22(SS)
TON: CTON.1 REG.19(TON) RTON.1 TON.1
VCC: CVC.1 REG.21(VCC)
VIN: CIN1.2 CIN2.2 CIN3.2 J6.9 J7.9 J8.9 Q22.P$3(D) Q23.P$3(D) Q24.P$3(D) Q25.P$3(D) Q26.P$3(D) Q27.P$3(D) Q28.P$3(D) Q29.P$3(D) Q30.P$3(D) Q31.P$3(D) Q32.P$3(D) Q33.P$3(D) Q34.P$3(D) Q35.P$3(D) Q36.P$3(D) Q37.P$3(D) Q38.P$3(D) Q39.P$3(D) Q40.P$3(D) Q41.P$3(D) Q42.P$3(D) RECT.1 REG.6(AIN) REG.7(IN) REN.1 RTON.2 VIN.1
Unconnected: REG.4(NC_2) REG.5(NC) U3.7(NC) U3.8(INT) U3.17(GP7) U4.7(NC) U4.8(INT) U4.17(GP7) U5.7(NC) U5.8(INT) U5.17(GP7) U6.7(NC) U7.7(NC) U8.7(NC) U9.7(NC)

## Notes on the sheet
- Primary Lamp FETs and Port
- Secondary Lamp FETs and Port
- Overhead Lamp FETs and Port
- Spare Lamp FETs and Port
- Timer Digit 0 FETs and Port
- Timer Digit 1 FETs and Port
- Timer Digit 2 FETs and Port
- Power to ESP32 
  (via 3V3 REG)
- Power Input and Regulation

## Library data of the parts
3V1-3V20 = MCP40D17T-503E_LT:MCP40D17T-503E/LT; COPYRIGHT: Copyright (C) 2023 Ultra Librarian. All rights reserved.; DIGIKEY_PART_NUMBER_1: MCP40D17T-503E/LTCT-ND; DIGIKEY_PART_NUMBER_2: MCP40D17T-503E/LTDKR-ND; DIGIKEY_PART_NUMBER_3: MCP40D17T-503E/LTTR-ND; MANUFACTURER_PART_NUMBER: MCP40D17T-503E/LT; MFR_NAME: Microchip
C2 CB CEN = OPL_Capacitor:CERAMIC-1NF-50V-5%-C0G(0603): 302010341; MPN: GRM1885C1H102JA01D; VALUE: 1nf
C3 C4 CIN1-CIN3 = OPL_Capacitor:CERAMIC-4.7UF-25V-10%-X5R(0805): 302010146; MPN: CC0805KKX5R8BB475; VALUE: 4.7uf
C5 CSS = OPL_Capacitor:CERAMIC-1NF-50V-10%-X7R(0603): 302010141; MPN: CC0603KRX7R9BB102; VALUE: 1nf
COUT1-COUT4 = OPL_Capacitor:CERAMIC-10UF-25V-10%-X5R(1206): 302010181; MPN: CC1206KKX5R8BB106; VALUE: 10uf
CTON = OPL_Capacitor:CERAMIC-1.5PF-50V-0.1PF-NPO(0402): 302010023; MPN: CC0402BRNPO9BN1R5; VALUE: 1.5PF
CVC = OPL_Capacitor:CERAMIC-390PF-50V-10%-X7R(0402): 302010260; MPN: CC0402KRX7R9BB391; VALUE: 390PF 50V
D1-D7 D11-D45 = ML_library:VLMY1500-GS08; COPYRIGHT: Copyright (C) 2022 Ultra Librarian. All rights reserved.; DIGI-KEY_PART_NUMBER_1: VLMY1500-GS08TR-ND; DIGI-KEY_PART_NUMBER_2: VLMY1500-GS08CT-ND; DIGI-KEY_PART_NUMBER_3: VLMY1500-GS08DKR-ND; MANUFACTURER_PART_NUMBER: VLMY1500-GS08; MFR_NAME: Vishay
DEN = ML_library:ZENER_SOT23
EN FB LX TON VIN = ML_library:CONN_HDR_1POS_0.1: 1x1 0.1" header pin
ESP_HDR_LEFT ESP_HDR_RIGHT = PPTC191LFBN-RC:PPTC191LFBN-RC: CONN HEADER FEMALE 19POS.1" TIN Source: Datasheet <https://drawings-pdf.s3.amazonaws.com/10492.pdf>; DESCRIPTION: CONN HEADER FEMALE 19POS.1" TIN; HEIGHT: 8.7mm; MANUFACTURER_NAME: Sullins; MANUFACTURER_PART_NUMBER: PPTC191LFBN-RC
J2-J5 = EB21A-06-D:EB21A-06-D; COPYRIGHT: Copyright (C) 2023 Ultra Librarian. All rights reserved.; MANUFACTURER_PART_NUMBER: EB21A-06-D; MFR_NAME: ADAM TECHNOLOGIES INC
J6-J8 = 282837-9:282837-9; CHECK_PRICES: https://www.snapeda.com/parts/282837-9/TE+Connectivity+AMP+Connectors/view-part/?ref=eda; COMMENT: 282837-9; DESCRIPTION: TERMI-BLOK PCB MOUNT 9P; DIGIKEY_PART_NUMBER: A135915-ND; EU_ROHS_COMPLIANCE: Compliant with Exemptions; MF: TE Connectivity; MP: 282837-9; PACKAGE: None; PURCHASE-URL: https://pricing.snapeda.com/search?q=282837-9&ref=eda; SNAPEDA_LINK: https://www.snapeda.com/parts/282837-9/TE+Connectivity+AMP+Connectors/view-part/?ref=snap
J9 = 1715250000-2pin_screw_terminal_block:1715250000; COPYRIGHT: Copyright (C) 2023 Ultra Librarian. All rights reserved.; DIGIKEY_PART_NUMBER_1: 281-1414-ND; MANUFACTURER_PART_NUMBER: 1715250000; MFR_NAME: Weidmuller
L1 = ML_library:BCIH1367-2R2M: BCIH1367-2R2M JLC Part #: C237973 2.2uH, 22A, 4.2mOhms, 13.4x12.6mm
Q1-Q5 Q7-Q42 = ML_library:DMN2056U-7: DMN2056U-7 N-Channel Mosfet Datasheet: https://www.diodes.com/assets/Datasheets/DMN2056U.pdf
R1 R2 R4 R7 R8 R10-R12 R14 R15 R18 R19 R21 R24 R25 R27 R28 R30 R34 R36 R37 R39 R40 R42 R43 R45 R46 R48 R49 R51 R52 R54 R55 R57 R58 R60 R61 R63 R64 R66 R67 R69 R70 R72 R73 R75 R76 R78 R79 R81 R82 R84 R85 R87 R88 R90 R91 R93 R94 R96 R97 R99 R100 R102 R103 R105 R106 R108 R109 R111 R112 R114 R115 R117 R118 R120 R121 R123 R124 R126 R127 R129 R130 R132 RTON = OPL_Resistor:SMD-RES-0R-1%-1/10W(0603): 301012029; MPN: RC0603FR-071K5L; VALUE: 1.5K
R3 R31 = OPL_Resistor:SMD-RES-1.5K-1%-1/16W(0402): 301011987; MPN: RC0402JR-070RL; VALUE: 0R
R5 R6 R9 R13 R17 R20 R26 R29 R35 R38 R41 R44 R47 R50 R53 R56 R59 R62 R65 R68 R71 R74 R77 R80 R83 R86 R89 R92 R95 R98 R101 R104 R107 R110 R113 R116 R119 R122 R125 R128 R131 REN = OPL_Resistor:SMD-RES-1.2K-1%-1/10W(0603): 301012041; MPN: RC0603FR-071K5L; VALUE: 1.5K
R16 = ML_library:DIP-RES-(PR-D2.7XL8.5MM): 301020000; MPN: FHCFR-1/4W-102J; VALUE: 1K
R22 R23 = OPL_Resistor:SMD-RES-1.5K-1%-1/16W(0402): 301011987; MPN: RC0402JR-070RL
R32 R133 R135 R137 R139 R141 R143 R145 R147 R149 R151 R153 R155 R157 R159 R161 R163 R165 R167 R169 = RLC16-R100JTP - 100mOhm:RLC16-R100JTP; COPYRIGHT: Copyright (C) 2023 Ultra Librarian. All rights reserved.; DIGIKEY_PART_NUMBER_1: 2315-RLC16-R100JTPTR-ND; MANUFACTURER_PART_NUMBER: RLC16-R100JTP; MFR_NAME: Kamaya
R33 R134 R136 R138 R140 R142 R144 R146 R148 R150 R152 R154 R156 R158 R160 R162 R164 R166 R168 R170 = CR-02JL6----1K:CR-02JL6----1K; COPYRIGHT: Copyright (C) 2023 Ultra Librarian. All rights reserved.; DIGIKEY_PART_NUMBER_1: 2577-CR-02JL6----1KTR-ND; MANUFACTURER_PART_NUMBER: CR-02JL6----1K; MFR_NAME: Viking
RECT = ML_library:DBF310-13; COPYRIGHT: Copyright (C) 2022 Ultra Librarian. All rights reserved.; DIGI-KEY_PART_NUMBER_1: DBF310-13DITR-ND; DIGI-KEY_PART_NUMBER_2: DBF310-13DICT-ND; DIGI-KEY_PART_NUMBER_3: DBF310-13DIDKR-ND; MANUFACTURER_PART_NUMBER: DBF310-13; MFR_NAME: Diodes Inc
REG = ML_library:AOZ2255LQI-31; COPYRIGHT: Copyright (C) 2022 Ultra Librarian. All rights reserved.; DIGI-KEY_PART_NUMBER_1: 785-AOZ2255LQI-31TR-ND; DIGI-KEY_PART_NUMBER_2: 785-AOZ2255LQI-31CT-ND; DIGI-KEY_PART_NUMBER_3: 785-AOZ2255LQI-31DKR-ND; MANUFACTURER_PART_NUMBER: AOZ2255LQI-31; MFR_NAME: Alpha and Omega Semiconductor
TP1 TP4 TP5 = testpad:TP: Test pad
U1 U10-U18 = LM358ADR:LM358ADR; COPYRIGHT: Copyright (C) 2023 Ultra Librarian. All rights reserved.; DIGIKEY_PART_NUMBER_1: 296-14601-1-ND; DIGIKEY_PART_NUMBER_2: 296-14601-2-ND; DIGIKEY_PART_NUMBER_3: 296-14601-6-ND; DIGIKEY_PART_NUMBER_4: 2156-LM358ADR-ND; MANUFACTURER_PART_NUMBER: LM358ADR; MFR_NAME: Texas Instruments
U2 = ML_library:AP2112K-3.3TRG1; COPYRIGHT: Copyright (C) 2022 Ultra Librarian. All rights reserved.; DIGI-KEY_PART_NUMBER_1: AP2112K-3.3TRG1DICT-ND; DIGI-KEY_PART_NUMBER_2: AP2112K-3.3TRG1DIDKR-ND; DIGI-KEY_PART_NUMBER_3: AP2112K-3.3TRG1DITR-ND; MANUFACTURER_PART_NUMBER: AP2112K-3.3TRG1; MFR_NAME: Diodes Inc
U3-U5 = MCP23008-E_P:MCP23008-E/P: IC I/O EXPANDER I2C 8B; CHECK_PRICES: https://www.snapeda.com/parts/MCP23008-E/P/Microchip/view-part/?ref=eda; DESCRIPTION: I/O Expander 8 I²C 1.7 MHz 18-PDIP; DIGIKEY_PART_NUMBER: MCP23008-E/P-ND; MF: Microchip; MP: MCP23008-E/P; PACKAGE: PDIP-18 Microchip; PURCHASE-URL: https://pricing.snapeda.com/search?q=MCP23008-E/P&ref=eda; SNAPEDA_LINK: https://www.snapeda.com/parts/MCP23008-E/P/Microchip/view-part/?ref=snap
U6-U9 = MC74HCT4851ADR2G:MC74HCT4851ADR2G; COPYRIGHT: Copyright (C) 2023 Ultra Librarian. All rights reserved.; DIGIKEY_PART_NUMBER_1: MC74HCT4851ADR2G-ND; DIGIKEY_PART_NUMBER_2: 2156-MC74HCT4851ADR2G-OS-ND; MANUFACTURER_PART_NUMBER: MC74HCT4851ADR2G; MFR_NAME: onsemi
U$3 = NC_MARKER:NC_MARKER